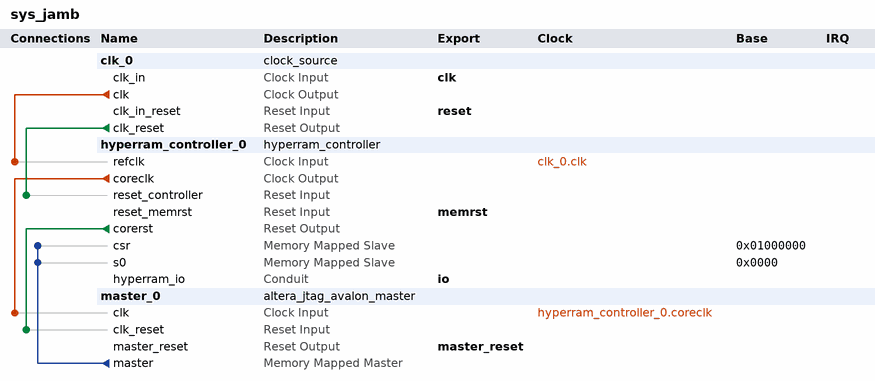
[diagram p0: system contents]
# Platform Designer (Qsys) system sys_jamb, Cyclone 10 LP 10CL025YU256I7G
# Parameters at their usual value, and those the tool derives, are not listed.
package require -exact qsys 24.1
create_system sys_jamb
set_project_property DEVICE_FAMILY {Cyclone 10 LP}
set_project_property DEVICE 10CL025YU256I7G

add_instance clk_0 clock_source 24.1
set_instance_parameter_value clk_0 clockFrequency 50000000

add_instance hyperram_controller_0 hyperram_controller 0.3

add_instance master_0 altera_jtag_avalon_master 24.1

# connections
add_connection clk_0.clk hyperram_controller_0.refclk clock
add_connection hyperram_controller_0.coreclk master_0.clk clock
add_connection clk_0.clk_reset hyperram_controller_0.reset_controller reset
add_connection hyperram_controller_0.corerst master_0.clk_reset reset
add_connection master_0.master hyperram_controller_0.csr avalon
set_connection_parameter_value master_0.master/hyperram_controller_0.csr baseAddress 0x01000000
add_connection master_0.master hyperram_controller_0.s0 avalon
set_connection_parameter_value master_0.master/hyperram_controller_0.s0 baseAddress 0x0000

# exported interfaces
add_interface clk clock sink
set_interface_property clk EXPORT_OF clk_0.clk_in
add_interface io conduit end
set_interface_property io EXPORT_OF hyperram_controller_0.hyperram_io
add_interface master_reset reset source
set_interface_property master_reset EXPORT_OF master_0.master_reset
add_interface memrst reset sink
set_interface_property memrst EXPORT_OF hyperram_controller_0.reset_memrst
add_interface reset reset sink
set_interface_property reset EXPORT_OF clk_0.clk_in_reset

set_interconnect_requirement {$system} qsys_mm.clockCrossingAdapter HANDSHAKE
set_interconnect_requirement {$system} qsys_mm.enableEccProtection FALSE
set_interconnect_requirement {$system} qsys_mm.insertDefaultSlave FALSE
set_interconnect_requirement {$system} qsys_mm.maxAdditionalLatency 1

save_system sys_jamb.qsys
